# Altium project PWM_CONTROLLER_nverter_540VDC_V3.PrjPcb
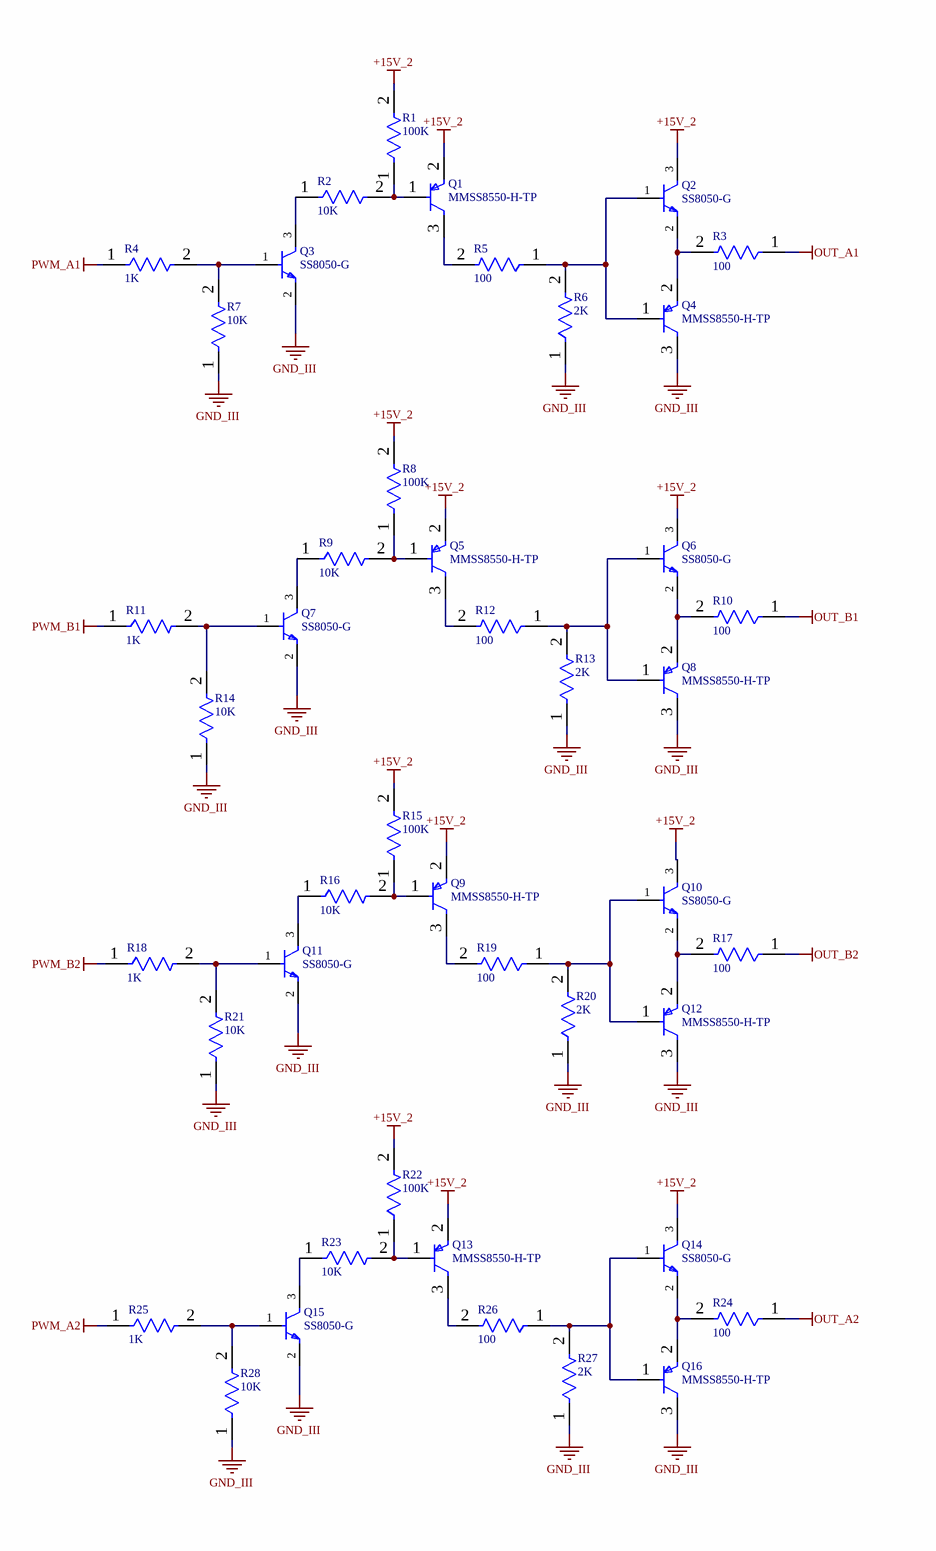
[diagram p0: PWM_CONTROLLER_nverter_540VDC_V3.SchDoc, top middle]
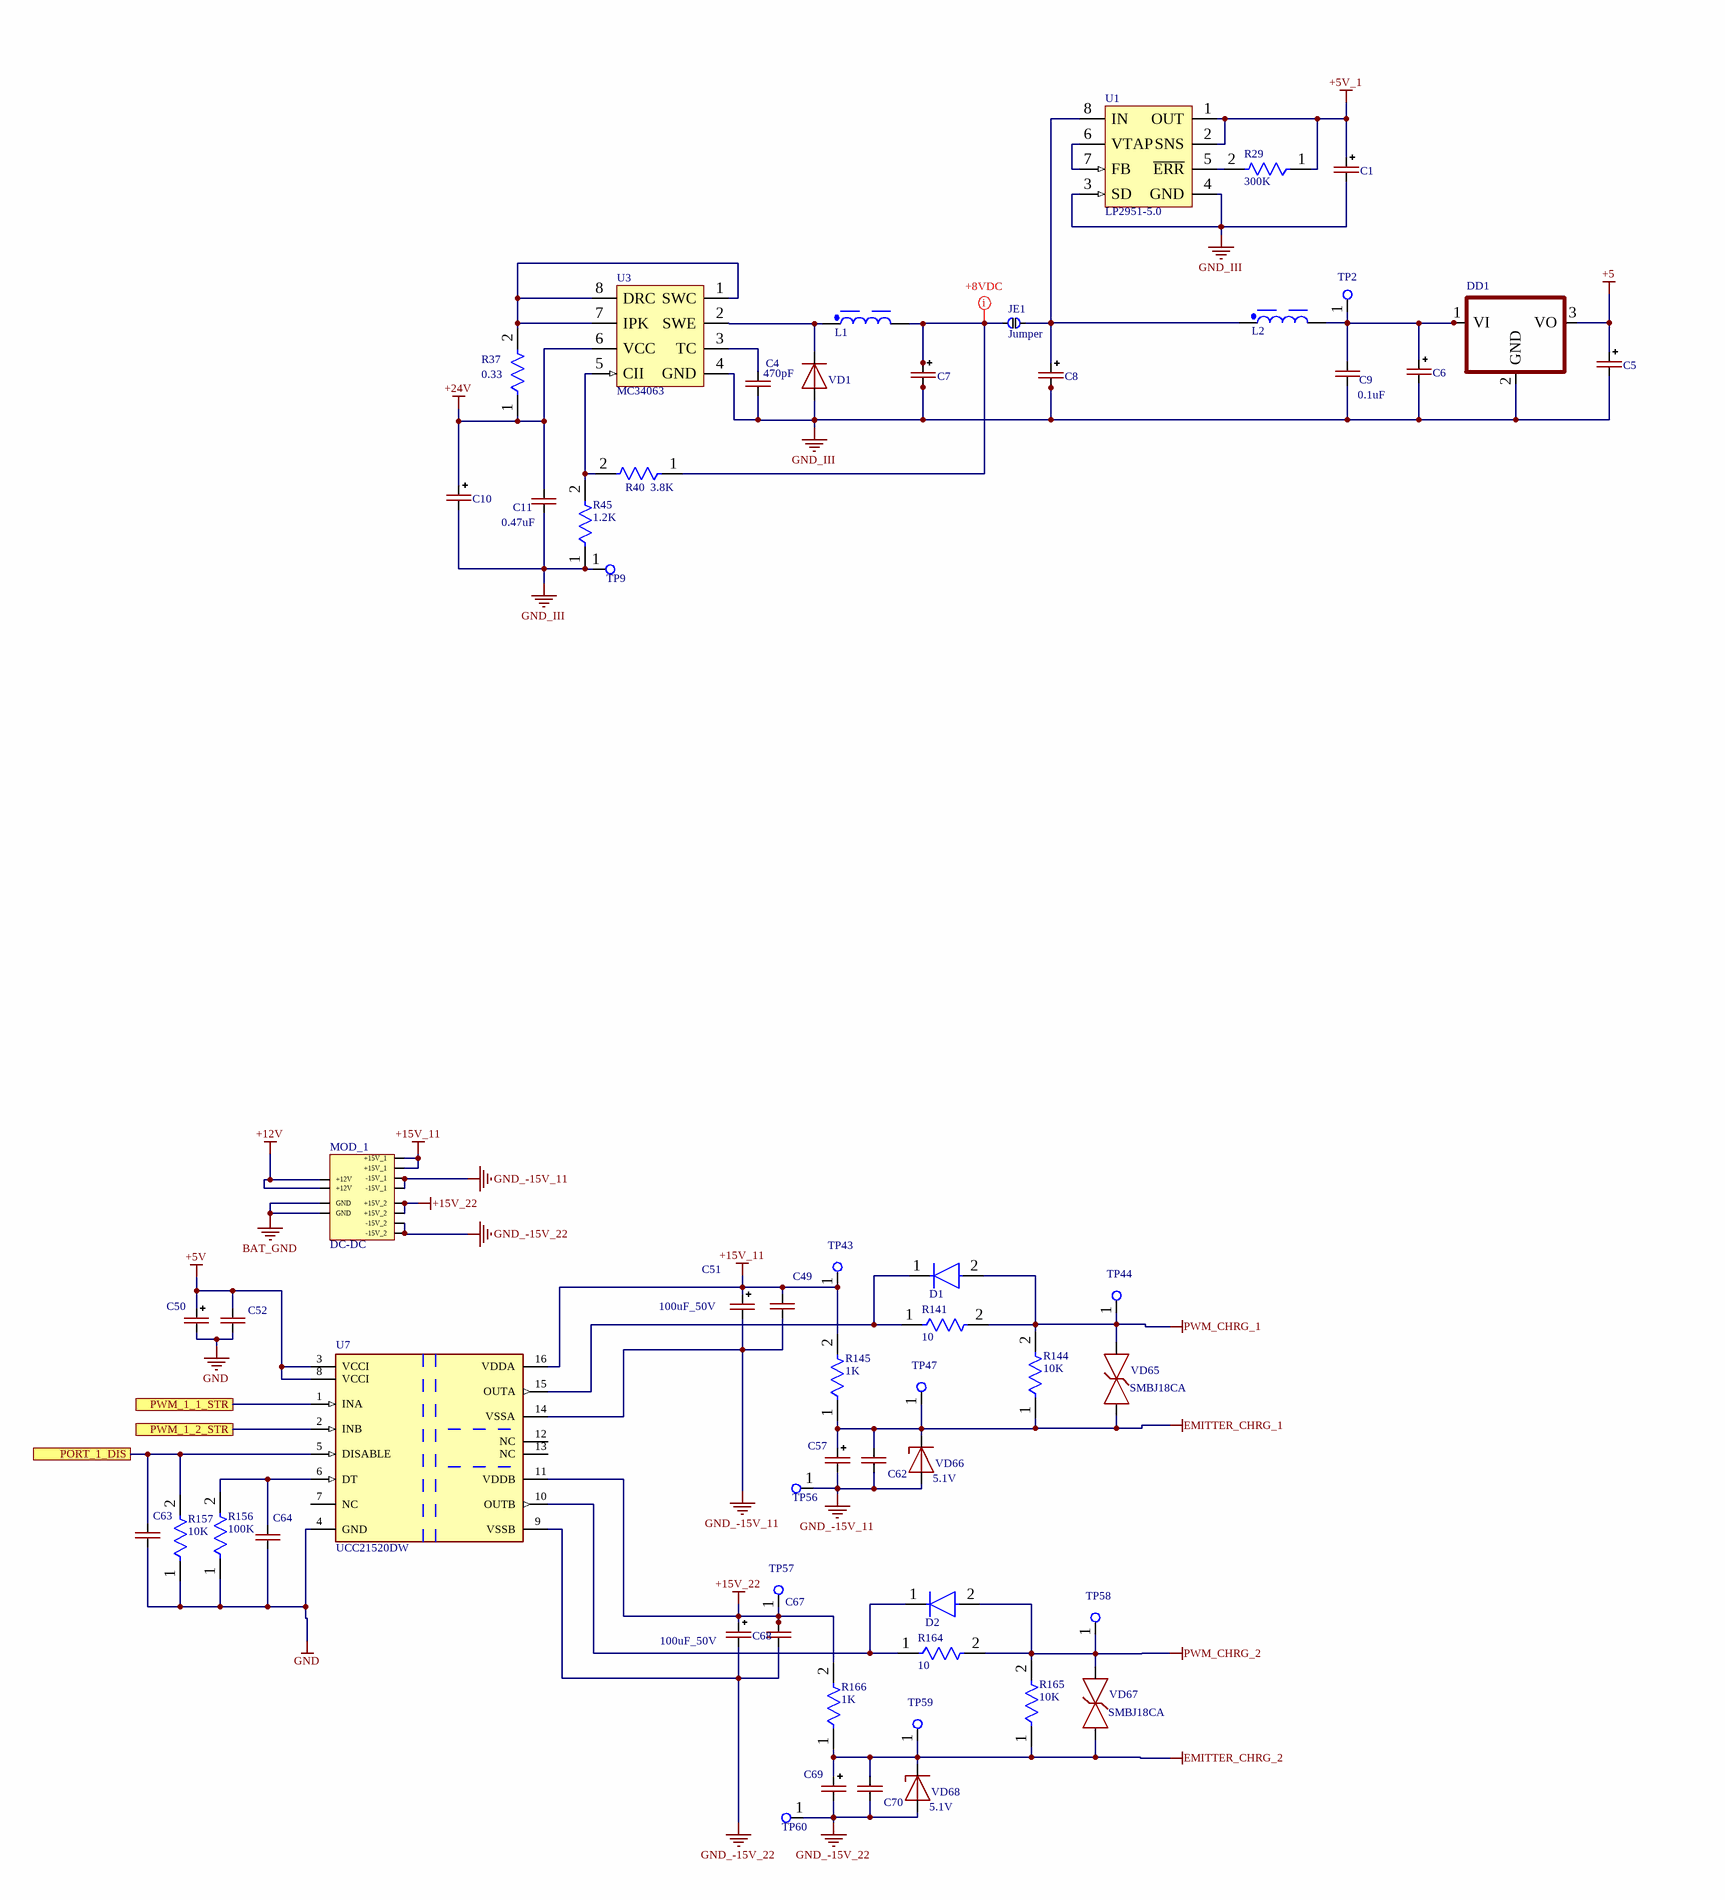
[diagram p1: PWM_CONTROLLER_nverter_540VDC_V3.SchDoc, bottom left]
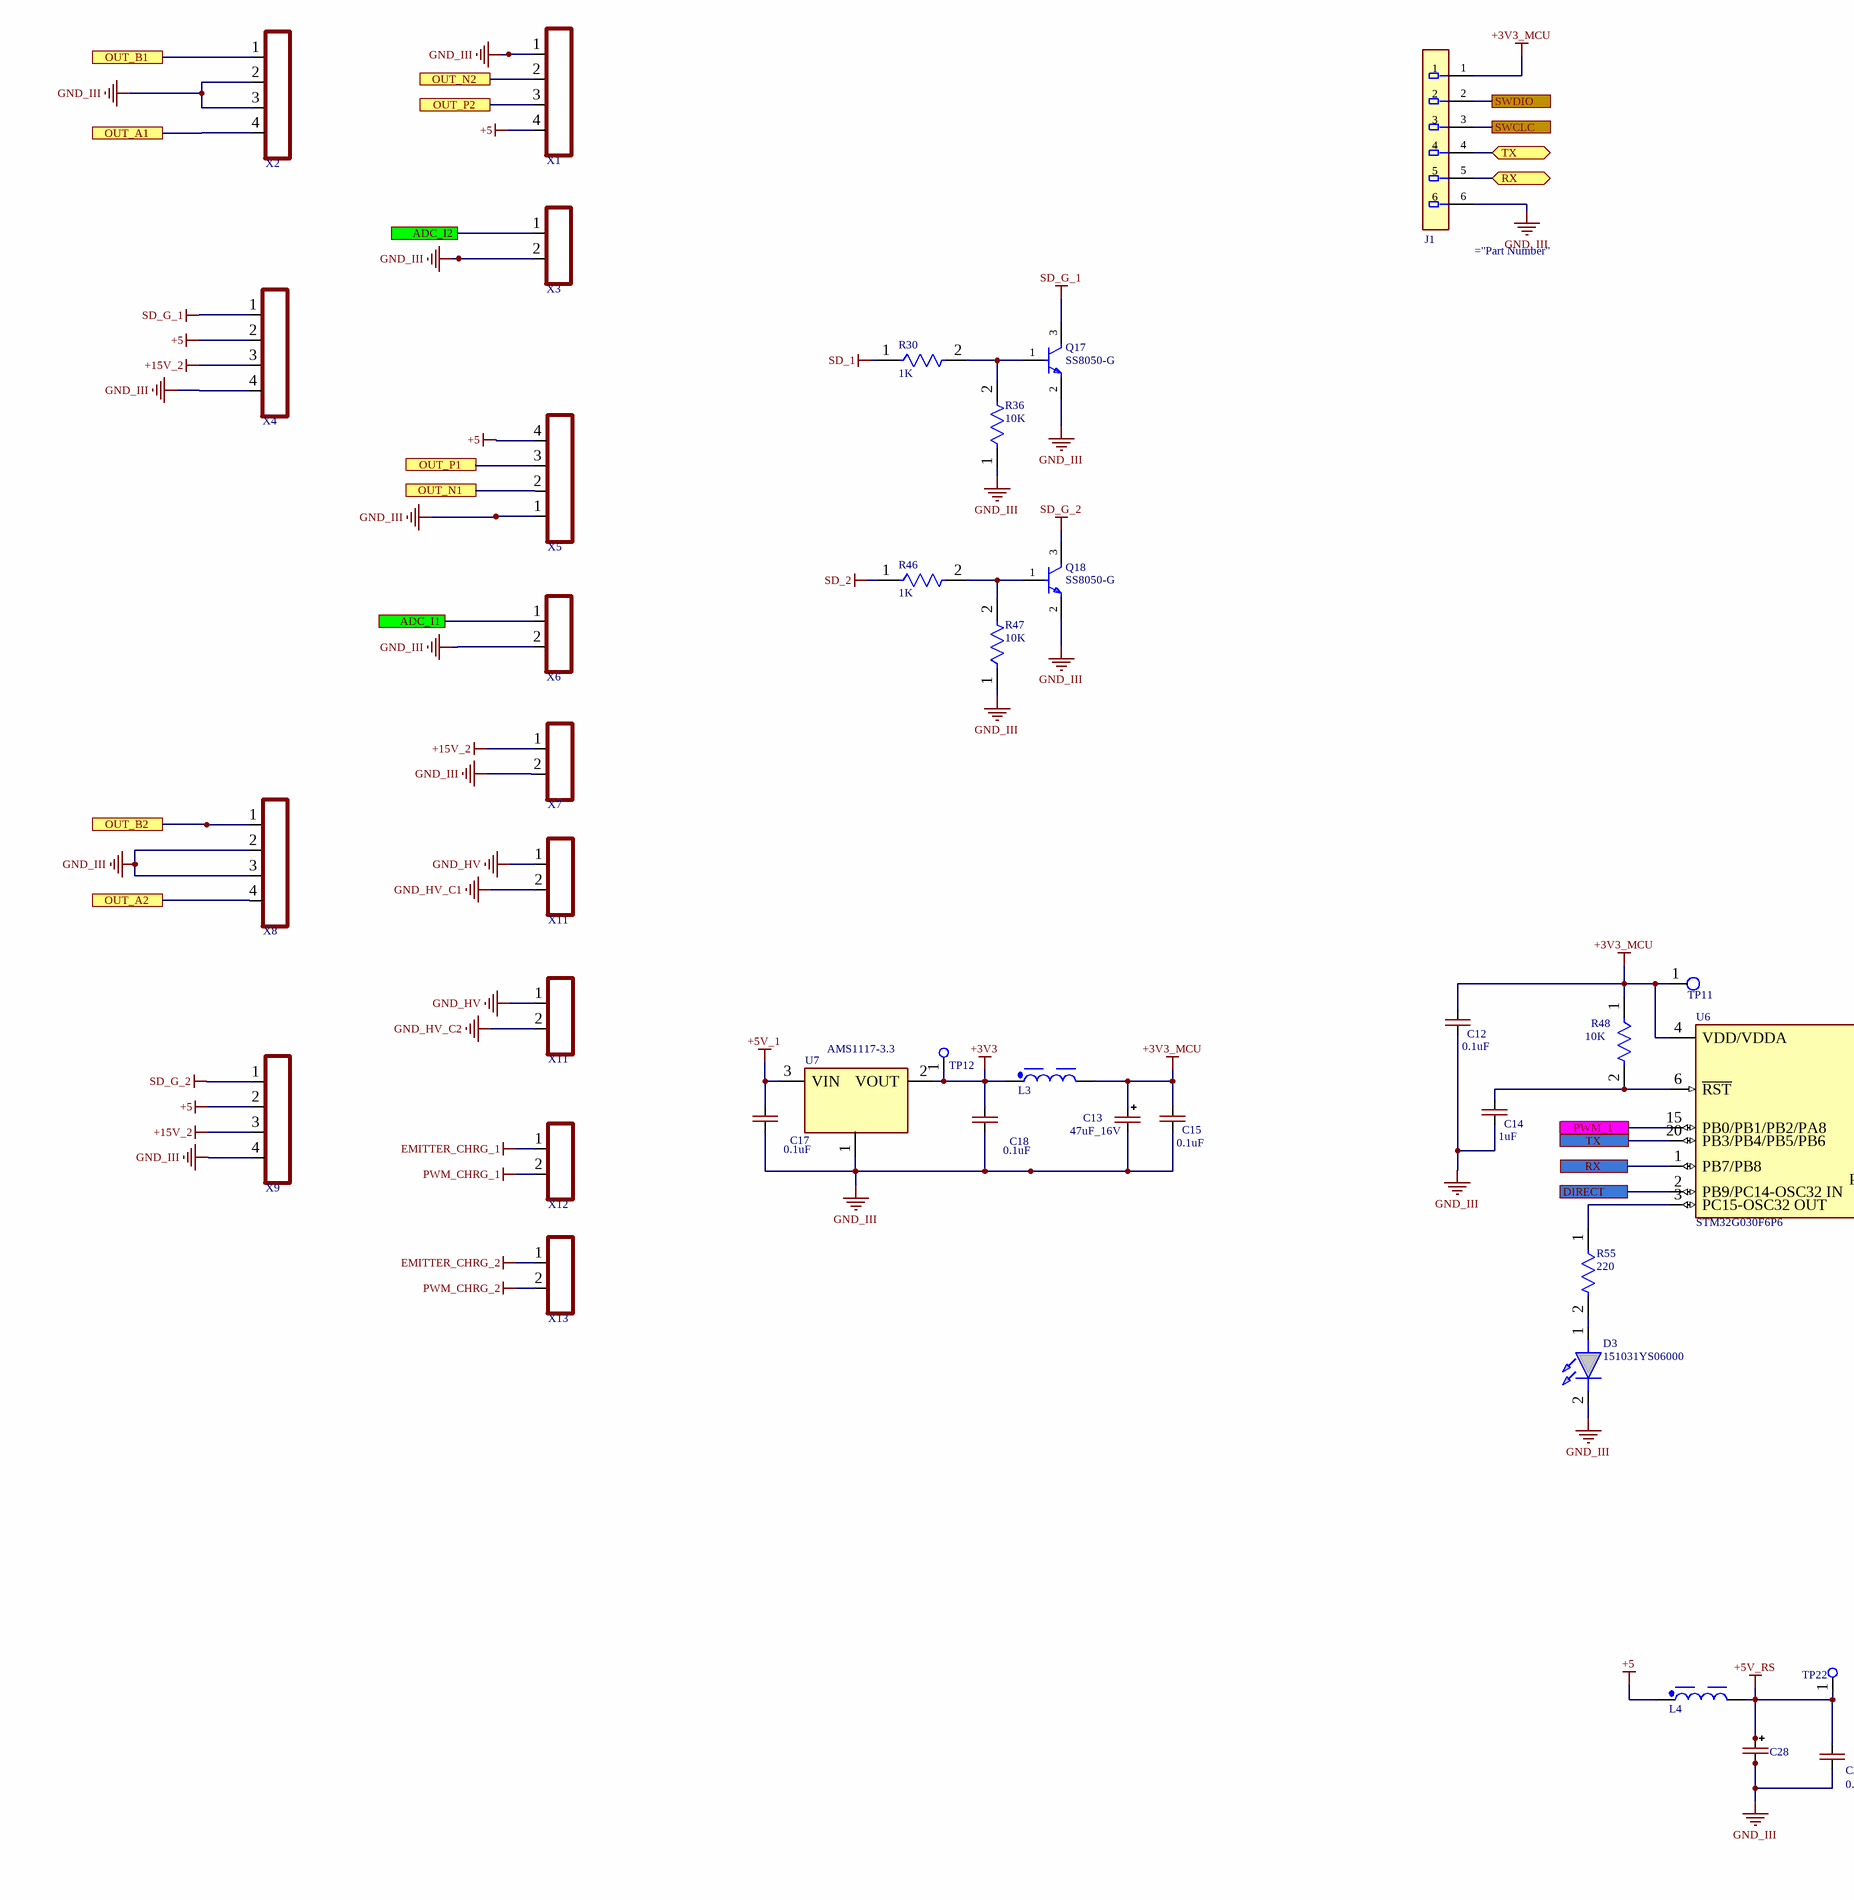
[diagram p2: PWM_CONTROLLER_nverter_540VDC_V3.SchDoc, bottom middle]
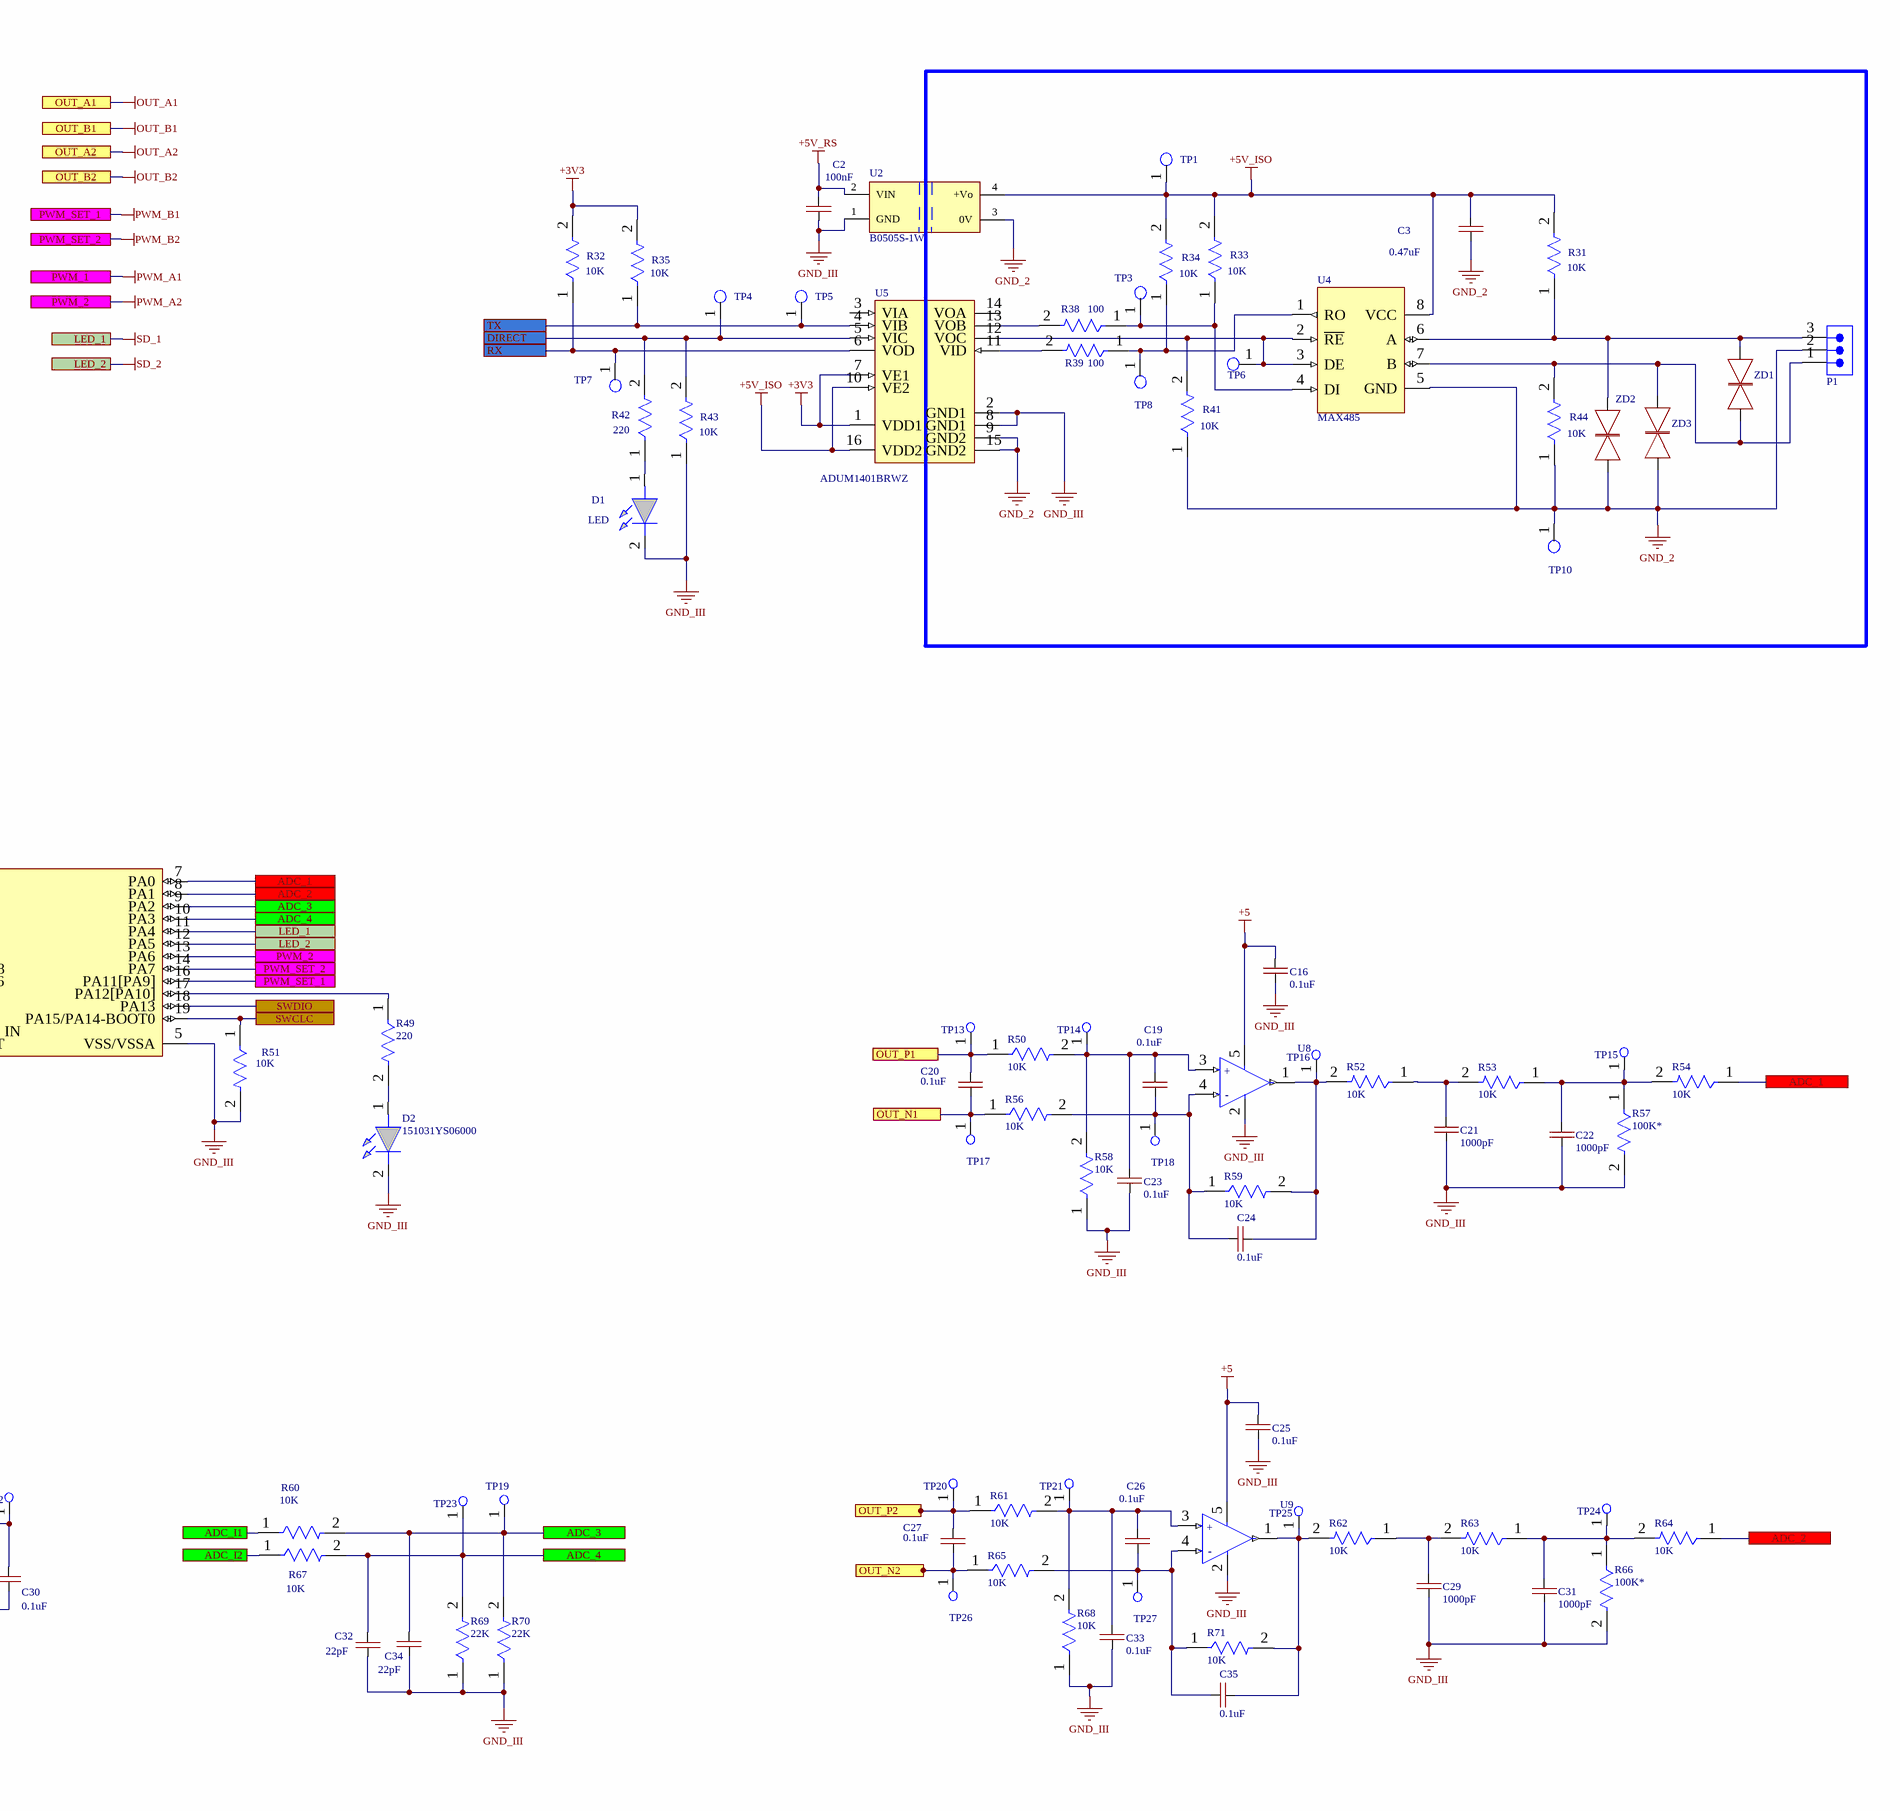
[diagram p3: PWM_CONTROLLER_nverter_540VDC_V3.SchDoc, bottom right]
1 sheet, 224 parts. Net scope: flat (ports and power ports of the same name join across sheets).
Board file: PWM_CONTROLLER_nverter_540VDC_V3.PcbDoc

## Sheet PWM_CONTROLLER_nverter_540VDC_V3.SchDoc
size A0; SheetNumber: 1; SheetTotal: 1; SPICEModelCacheYQEDCYZF: <root> / <DocumentId>YQEDCYZF</DocumentId> / <CacheFrame Number="0"> / <Model Name="7850_74477530_1m" Kind="CKT"> / <Text>******* / .subckt 7850_74477530_1m 1 2 / Rp 1 2 187304.915771 / Cp 1 2 4.36976277949p / Rs 1 N3 3.3 / L1 N3 2 1000u / .ends 7850_74477530_1m</Text> / </Model> / </CacheFrame> / </root>

### Parts
(Parts that share a designator on the sheet are numbered #1, #2 ... from top to bottom, then left to right.)
C1  CAP-POLAR  [CAP-TAN-C]  (value not drawn)
C2  100nF  [CAP-0805]
C3  0.47uF  [CAP-0805]
C4  470pF  [CAP-0805]
C5  CAP-POLAR  [CAP-TAN-C]  (value not drawn)
C6  CAP-POLAR  [CAP-TAN-C]  (value not drawn)
C7  CAP-POLAR  [CAP-TAN-C]  (value not drawn)
C8  CAP-POLAR  [CAP-TAN-C]  (value not drawn)
C9  0.1uF  [CAP-0805]
C10  CAP-POLAR  [CAPPOL_SMD_SIZE_D]  (value not drawn)
C11  0.47uF  [CAP-0805]
C12  0.1uF  [CAP-0805]
C13  47uF_16V  [CAP-TAN-D]
C14  1uF  [CAP-0805]
C15  0.1uF  [CAP-0805]
C16  0.1uF  [CAP-0805]
C17  0.1uF  [CAP-0805]
C18  0.1uF  [CAP-0805]
C19  0.1uF  [CAP-0805]
C20  0.1uF  [CAP-0805]
C21  1000pF  [CAP-0805]
C22  1000pF  [CAP-0805]
C23  0.1uF  [CAP-0805]
C24  0.1uF  [CAP-0805]
C25  0.1uF  [CAP-0805]
C26  0.1uF  [CAP-0805]
C27  0.1uF  [CAP-0805]
C28  CAP-POLAR  [CAP-TAN-C]  (value not drawn)
C29  1000pF  [CAP-0805]
C30  0.1uF  [CAP-0805]
C31  1000pF  [CAP-0805]
C32  22pF  [CAP-0805]
C33  0.1uF  [CAP-0805]
C34  22pF  [CAP-0805]
C35  0.1uF  [CAP-0805]
C49  CAP-NON-POLAR  [CAP-0805]  (value not drawn)
C50  CAP-POLAR  [CAP-TAN-D]  (value not drawn)
C51  100uF_50V  [CAP_SMD_Size_E]
C52  CAP-NON-POLAR  [CAP-0805]  (value not drawn)
C57  CAP-POLAR  [CAP-TAN-D]  (value not drawn)
C62  CAP-NON-POLAR  [CAP-0805]  (value not drawn)
C63  CAP-NON-POLAR  [CAP-0805]  (value not drawn)
C64  CAP-NON-POLAR  [CAP-0805]  (value not drawn)
C67  CAP-NON-POLAR  [CAP-0805]  (value not drawn)
C68  100uF_50V  [CAP_SMD_Size_E]
C69  CAP-POLAR  [CAP-TAN-D]  (value not drawn)
C70  CAP-NON-POLAR  [CAP-0805]  (value not drawn)
D1#1  LED  [LED_RED]
D1#2  US1G  [US1G_SMA]  (value not drawn)
D2#1  151031YS06000  [LED_RED]
D2#2  US1G  [US1G_SMA]  (value not drawn)
D3  151031YS06000  [LED_RED]
DD1  78M05  [DPAK]  (value not drawn)
J1  SWR25X-NRTC-S06-ST-BA  [Sullins_SWR25X-NRTC-S06-ST-BA_MFG]  (value not drawn)
JE1  Jumper  [JE]
L1  1000µH, 0.3A  [WE-PD2_7850]  (value not drawn)
L2  1000µH, 0.3A  [WE-PD2_7850]  (value not drawn)
L3  1000µH, 0.3A  [WE-PD2_7850]  (value not drawn)
L4  1000µH, 0.3A  [WE-PD2_7850]  (value not drawn)
MOD_1  DC-DC  [DC-DC_Bridge]
P1  691701530003B  [691701530003B]  (value not drawn)
Q1  MMSS8550-H-TP  [FP-SOT-23-IPC_B]
Q2  SS8050-G  [FP-SS8050-G-MFG]
Q3  SS8050-G  [FP-SS8050-G-MFG]
Q4  MMSS8550-H-TP  [FP-SOT-23-IPC_B]
Q5  MMSS8550-H-TP  [FP-SOT-23-IPC_B]
Q6  SS8050-G  [FP-SS8050-G-MFG]
Q7  SS8050-G  [FP-SS8050-G-MFG]
Q8  MMSS8550-H-TP  [FP-SOT-23-IPC_B]
Q9  MMSS8550-H-TP  [FP-SOT-23-IPC_B]
Q10  SS8050-G  [FP-SS8050-G-MFG]
Q11  SS8050-G  [FP-SS8050-G-MFG]
Q12  MMSS8550-H-TP  [FP-SOT-23-IPC_B]
Q13  MMSS8550-H-TP  [FP-SOT-23-IPC_B]
Q14  SS8050-G  [FP-SS8050-G-MFG]
Q15  SS8050-G  [FP-SS8050-G-MFG]
Q16  MMSS8550-H-TP  [FP-SOT-23-IPC_B]
Q17  SS8050-G  [FP-SS8050-G-MFG]
Q18  SS8050-G  [FP-SS8050-G-MFG]
R1  100K  [RES-0805]
R2  10K  [RES-0805]
R3  100  [RES-0805]
R4  1K  [RES-0805]
R5  100  [RES-0805]
R6  2K  [RES-0805]
R7  10K  [RES-0805]
R8  100K  [RES-0805]
R9  10K  [RES-0805]
R10  100  [RES-0805]
R11  1K  [RES-0805]
R12  100  [RES-0805]
R13  2K  [RES-0805]
R14  10K  [RES-0805]
R15  100K  [RES-0805]
R16  10K  [RES-0805]
R17  100  [RES-0805]
R18  1K  [RES-0805]
R19  100  [RES-0805]
R20  2K  [RES-0805]
R21  10K  [RES-0805]
R22  100K  [RES-0805]
R23  10K  [RES-0805]
R24  100  [RES-0805]
R25  1K  [RES-0805]
R26  100  [RES-0805]
R27  2K  [RES-0805]
R28  10K  [RES-0805]
R29  300K  [RES-0805]
R30  1K  [RES-0805]
R31  10K  [RES-0805]
R32  10K  [RES-0805]
R33  10K  [RES-0805]
R34  10K  [RES-0805]
R35  10K  [RES-0805]
R36  10K  [RES-0805]
R37  0.33  [RES-1206]
R38  100  [RES-0805]
R39  100  [RES-0805]
R40  3.8K  [RES-0805]
R41  10K  [RES-0805]
R42  220  [RES-0805]
R43  10K  [RES-0805]
R44  10K  [RES-0805]
R45  1.2K  [RES-0805]
R46  1K  [RES-0805]
R47  10K  [RES-0805]
R48  10K  [RES-0805]
R49  220  [RES-0805]
R50  10K  [RES-0805]
R51  10K  [RES-0805]
R52  10K  [RES-0805]
R53  10K  [RES-0805]
R54  10K  [RES-0805]
R55  220  [RES-0805]
R56  10K  [RES-0805]
R57  100K*  [RES-0805]
R58  10K  [RES-0805]
R59  10K  [RES-0805]
R60  10K  [RES-0805]
R61  10K  [RES-0805]
R62  10K  [RES-0805]
R63  10K  [RES-0805]
R64  10K  [RES-0805]
R65  10K  [RES-0805]
R66  100K*  [RES-0805]
R67  10K  [RES-0805]
R68  10K  [RES-0805]
R69  22K  [RES-0805]
R70  22K  [RES-0805]
R71  10K  [RES-0805]
R141  10  [RES-2512]
R144  10K  [RES-0805]
R145  1K  [RES-2512]
R156  100K  [RES-0805]
R157  10K  [RES-0805]
R164  10  [RES-2512]
R165  10K  [RES-0805]
R166  1K  [RES-2512]
TP1  Test_Point_PCB  [Test_Point]  (value not drawn)
TP2  Test_Point_PCB  [Test_Point]  (value not drawn)
TP3  Test_Point_PCB  [Test_Point]  (value not drawn)
TP4  Test_Point_PCB  [Test_Point]  (value not drawn)
TP5  Test_Point_PCB  [Test_Point]  (value not drawn)
TP6  Test_Point_PCB  [Test_Point]  (value not drawn)
TP7  Test_Point_PCB  [Test_Point]  (value not drawn)
TP8  (no value)  [Test_Point]
TP9  Test_Point_PCB  [Test_Point]  (value not drawn)
TP10  Test_Point_PCB  [Test_Point]  (value not drawn)
TP11  (no value)  [Test_Point]
TP12  Test_Point_PCB  [Test_Point]  (value not drawn)
TP13  Test_Point_PCB  [Test_Point]  (value not drawn)
TP14  Test_Point_PCB  [Test_Point]  (value not drawn)
TP15  Test_Point_PCB  [Test_Point]  (value not drawn)
TP16  Test_Point_PCB  [Test_Point]  (value not drawn)
TP17  Test_Point_PCB  [Test_Point]  (value not drawn)
TP18  Test_Point_PCB  [Test_Point]  (value not drawn)
TP19  Test_Point_PCB  [Test_Point]  (value not drawn)
TP20  Test_Point_PCB  [Test_Point]  (value not drawn)
TP21  Test_Point_PCB  [Test_Point]  (value not drawn)
TP22  Test_Point_PCB  [Test_Point]  (value not drawn)
TP23  Test_Point_PCB  [Test_Point]  (value not drawn)
TP24  Test_Point_PCB  [Test_Point]  (value not drawn)
TP25  Test_Point_PCB  [Test_Point]  (value not drawn)
TP26  Test_Point_PCB  [Test_Point]  (value not drawn)
TP27  Test_Point_PCB  [Test_Point]  (value not drawn)
TP43  Test_Point_PCB  [Test_Point]  (value not drawn)
TP44  Test_Point_PCB  [Test_Point]  (value not drawn)
TP47  Test_Point_PCB  [Test_Point]  (value not drawn)
TP56  Test_Point_PCB  [Test_Point]  (value not drawn)
TP57  Test_Point_PCB  [Test_Point]  (value not drawn)
TP58  Test_Point_PCB  [Test_Point]  (value not drawn)
TP59  Test_Point_PCB  [Test_Point]  (value not drawn)
TP60  Test_Point_PCB  [Test_Point]  (value not drawn)
U1  LP2951-5.0  [SOIC-8_L]
U2  B0505S-1W  [B0505S-1W]
U3  MC34063  [SOIC-8_M]
U4  MAX485  [SOIC-8-MFG]
U5  ADUM1401BRWZ  [ADI-RW-16_M]
U6  STM32G030F6P6  [FP-TSSOP20-YA-IPC_A]
U7#1  AMS1117-3.3  [SOT-223]
U7#2  UCC21520DW  [FP-DW0016B-MFG]
U8  (no value)  [SOT-23-5]
U9  (no value)  [SOT-23-5]
VD1  DIODE  [DO-214AC, SMA]  (value not drawn)
VD65  SMBJ18CA  [DO-214AA]
VD66  5.1V  [DO-35]
VD67  SMBJ18CA  [DO-214AA]
VD68  5.1V  [DO-35]
X1  CONN-4-PIN  [CONN-PLS-4-2.54mm_1]  (value not drawn)
X2  CONN-4-PIN  [CONN-PLS-4-2.54mm_1]  (value not drawn)
X3  CONN-2-PIN  [XH2-]  (value not drawn)
X4  CONN-4-PIN  [CONN-PLS-4-2.54mm_1]  (value not drawn)
X5  CONN-4-PIN  [CONN-PLS-4-2.54mm_1]  (value not drawn)
X6  CONN-2-PIN  [XH2-]  (value not drawn)
X7  CONN-2-PIN  [XH2-]  (value not drawn)
X8  CONN-4-PIN  [CONN-PLS-4-2.54mm_1]  (value not drawn)
X9  CONN-4-PIN  [CONN-PLS-4-2.54mm_1]  (value not drawn)
X11#1  CONN-2-PIN  [XH2-]  (value not drawn)
X11#2  CONN-2-PIN  [XH2-]  (value not drawn)
X12  CONN-2-PIN  [XH2-]  (value not drawn)
X13  CONN-2-PIN  [XH2-]  (value not drawn)
ZD1  P6SMB16CA  [DO-214AA]  (value not drawn)
ZD2  P6SMB16CA  [DO-214AA]  (value not drawn)
ZD3  P6SMB16CA  [DO-214AA]  (value not drawn)

### Ports
ADC_1, ADC_2, ADC_3, ADC_4, ADC_I1, ADC_I2, DIRECT, LED_1, LED_2, OUT_A1, OUT_A2, OUT_B1, OUT_B2, OUT_N1, OUT_N2, OUT_P1, OUT_P2, PORT_1_DIS, PWM_1, PWM_1_1_STR, PWM_1_2_STR, PWM_2, PWM_SET_1, PWM_SET_2, RX, RX (bidir), SWCLC, SWDIO, TX, TX (bidir)

### Nets
+3V3: C18.2 L3.1 R32.2 R35.2 TP12.1(G9) U5.1(VDD1) U5.7(VE1) U7#1.2(VOUT)
+3V3_MCU: C12.2 C13.1(+) C15.2 J1.1 L3.2 R48.1 TP11.1(G9) U6.4(VDD/VDDA)
+5: C5.1(+) C16.2 C25.2 DD1.3(VO) L4.1 U8.5(VDD) U9.5(VDD) X1.4 X4.2 X5.4 X9.2
+5V: C50.1(+) C52.2 U7#2.3(VCCI) U7#2.8(VCCI)
+5V_1: C1.1(+) C17.2 R29.1 U1.1(OUT) U1.2(SNS) U7#1.3(VIN)
+5V_ISO: C3.1 R31.2 R33.2 R34.2 TP1.1(G9) U2.4(+Vo) U4.8(VCC) U5.10(VE2) U5.16(VDD2)
+5V_RS: C2.2 C28.1(+) C30.2 L4.2 TP22.1(G9) U2.2(VIN)
+12V: MOD_1.8(+12V) MOD_1.9(+12V)
+15V_2: Q1.2(E) Q2.3(C) Q5.2(E) Q6.3(C) Q9.2(E) Q10.3(C) Q13.2(E) Q14.3(C) R1.2 R8.2 R15.2 R22.2 X4.3 X7.1 X9.3
+15V_11: C49.2 C51.1(+) MOD_1.1(+15V_1) MOD_1.2(+15V_1) R145.2 TP43.1(G9) U7#2.16(VDDA)
+15V_22: C67.2 C68.1(+) MOD_1.17(+15V_2) MOD_1.18(+15V_2) R166.2 TP57.1(G9) U7#2.11(VDDB)
+24V: C10.1(+) C11.1 R37.1 U3.6(VCC)
BAT_GND: MOD_1.10(GND) MOD_1.11(GND)
EMITTER_CHRG_1: C57.1(+) C62.2 R144.1 R145.1 TP47.1(G9) VD65.1(C) VD66.1(C) X12.1
EMITTER_CHRG_2: C69.1(+) C70.2 R165.1 R166.1 TP59.1(G9) VD67.1(C) VD68.1(C) X13.1
GND: C50.2(-) C52.1 C63.1 C64.1 R156.1 R157.1 U7#2.4(GND)
GND_2: C3.2 P1.2 R41.1 R44.1 TP10.1(G9) U2.3(0V) U4.5(GND) U5.9(GND2) U5.15(GND2) ZD2.1(A) ZD3.1(A)
GND_-15V_11: C49.1 C51.2(-) C57.2(-) C62.1 MOD_1.3(-15V_1) MOD_1.4(-15V_1) TP56.1(G9) U7#2.14(VSSA) VD66.2(A)
GND_-15V_22: C67.1 C68.2(-) C69.2(-) C70.1 MOD_1.15(-15V_2) MOD_1.16(-15V_2) TP60.1(G9) U7#2.9(VSSB) VD68.2(A)
GND_HV: X11#1.1 X11#2.1
GND_HV_C1: X11#1.2
GND_HV_C2: X11#2.2
GND_III: C1.2(-) C2.1 C4.2 C5.2(-) C6.2(-) C7.2(-) C8.2(-) C9.1 C10.2(-) C11.2 C12.1 C13.2(-) C14.1 C15.1 C16.1 C17.1 C18.1 C21.1 C22.1 C23.1 C25.1 C28.2(-) C29.1 C30.1 C31.1 C32.1 C33.1 C34.1 D1#1.2(K) D2#1.2(K) D3.2(K) DD1.2(GND) J1.6 Q3.2(E) Q4.3(C) Q7.2(E) Q8.3(C) Q11.2(E) Q12.3(C) Q15.2(E) Q16.3(C) Q17.2(E) Q18.2(E) R6.1 R7.1 R13.1 R14.1 R20.1 R21.1 R27.1 R28.1 R36.1 R43.1 R45.1 R47.1 R51.2 R57.2 R58.1 R66.2 R68.1 R69.1 R70.1 TP9.1(G9) U1.3(SD) U1.4(GND) U2.1(GND) U3.4(GND) U5.2(GND1) U5.8(GND1) U6.5(VSS/VSSA) U7#1.1(Ground) U8.2(VSS) U9.2(VSS) VD1.2(A) X1.1 X2.2 X2.3 X3.2 X5.1 X6.2 X7.2 X8.2 X8.3 X9.4
OUT_A1: R3.1 X2.4 ; port OUT_A1
OUT_A2: R24.1 X8.4 ; port OUT_A2
OUT_B1: R10.1 X2.1 ; port OUT_B1
OUT_B2: R17.1 X8.1 ; port OUT_B2
PWM_A1: R4.1 U6.15(PB0/PB1/PB2/PA8) ; port PWM_1
PWM_A2: R25.1 U6.13(PA6) ; port PWM_2
PWM_B1: R11.1 U6.16(PA11[PA9]) ; port PWM_SET_1
PWM_B2: R18.1 U6.14(PA7) ; port PWM_SET_2
PWM_CHRG_1: D1#2.2(A) R141.2 R144.2 TP44.1(G9) VD65.2(A) X12.2
PWM_CHRG_2: D2#2.2(A) R164.2 R165.2 TP58.1(G9) VD67.2(A) X13.2
SD_1: R30.1 U6.11(PA4) ; port LED_1
SD_2: R46.1 U6.12(PA5) ; port LED_2
SD_G_1: Q17.3(C) X4.1
SD_G_2: Q18.3(C) X9.1
NetC4_1: C4.1 U3.3(TC)
NetC6_1: C6.1(+) C9.2 DD1.1(VI) L2.2 TP2.1(G9)
NetC7_1: C7.1(+) JE1.2 L1.2 R40.1
NetC8_1: C8.1(+) JE1.1 L2.1 U1.8(IN)
NetC14_2: C14.2 R48.2 U6.6(~{RST})
NetC19_1: C19.1 C24.1 R56.2 R59.1 TP18.1(G9) U8.4(VIN-)
NetC19_2: C19.2 C23.2 R50.2 R58.2 TP14.1(G9) U8.3(VIN+)
NetC20_1: C20.1 R56.1 TP17.1(G9) X5.2 ; port OUT_N1
NetC20_2: C20.2 R50.1 TP13.1(G9) X5.3 ; port OUT_P1
NetC21_2: C21.2 R52.1 R53.2
NetC22_2: C22.2 R53.1 R54.2 R57.1 TP15.1(G9)
NetC24_2: C24.2 R52.2 R59.2 TP16.1(G9) U8.1(VOUT)
NetC26_1: C26.1 C35.1 R65.2 R71.1 TP27.1(G9) U9.4(VIN-)
NetC26_2: C26.2 C33.2 R61.2 R68.2 TP21.1(G9) U9.3(VIN+)
NetC27_1: C27.1 R65.1 TP26.1(G9) X1.2 ; port OUT_N2
NetC27_2: C27.2 R61.1 TP20.1(G9) X1.3 ; port OUT_P2
NetC29_2: C29.2 R62.1 R63.2
NetC31_2: C31.2 R63.1 R64.2 R66.1 TP24.1(G9)
NetC32_2: C32.2 R67.2 R69.2 TP23.1(G9) U6.10(PA3) ; port ADC_4
NetC34_2: C34.2 R60.2 R70.2 TP19.1(G9) U6.9(PA2) ; port ADC_3
NetC35_2: C35.2 R62.2 R71.2 TP25.1(G9) U9.1(VOUT)
NetC63_2: C63.2 R157.2 U7#2.5(DISABLE) ; port PORT_1_DIS
NetC64_2: C64.2 R156.2 U7#2.6(DT)
NetD1#1_1: D1#1.1(A) R42.1
NetD1#2_1: D1#2.1(C) R141.1 U7#2.15(OUTA)
NetD2#1_1: D2#1.1(A) R49.2
NetD2#2_1: D2#2.1(C) R164.1 U7#2.10(OUTB)
NetD3_1: D3.1(A) R55.2
NetJ1_2: J1.2 U6.18(PA13) ; port SWDIO
NetJ1_3: J1.3 R51.1 U6.19(PA15/PA14-BOOT0) ; port SWCLC
NetJ1_4: J1.4 R35.1 TP5.1(G9) U5.4(VIB) U6.20(PB3/PB4/PB5/PB6) ; port TX
NetJ1_5: J1.5 R32.1 TP7.1(G9) U5.6(VOD) U6.1(PB7/PB8) ; port RX
NetL1_1: L1.1 U3.2(SWE) VD1.1(C)
NetP1_1: P1.1 R44.2 U4.7(B) ZD1.1(A) ZD3.2(A)
NetP1_3: P1.3 R31.1 U4.6(A) ZD1.2(A) ZD2.2(A)
NetQ1_1: Q1.1(B) R1.1 R2.2
NetQ1_3: Q1.3(C) R5.2
NetQ2_1: Q2.1(B) Q4.1(B) R5.1 R6.2
NetQ2_2: Q2.2(E) Q4.2(E) R3.2
NetQ3_1: Q3.1(B) R4.2 R7.2
NetQ3_3: Q3.3(C) R2.1
NetQ5_1: Q5.1(B) R8.1 R9.2
NetQ5_3: Q5.3(C) R12.2
NetQ6_1: Q6.1(B) Q8.1(B) R12.1 R13.2
NetQ6_2: Q6.2(E) Q8.2(E) R10.2
NetQ7_1: Q7.1(B) R11.2 R14.2
NetQ7_3: Q7.3(C) R9.1
NetQ9_1: Q9.1(B) R15.1 R16.2
NetQ9_3: Q9.3(C) R19.2
NetQ10_1: Q10.1(B) Q12.1(B) R19.1 R20.2
NetQ10_2: Q10.2(E) Q12.2(E) R17.2
NetQ11_1: Q11.1(B) R18.2 R21.2
NetQ11_3: Q11.3(C) R16.1
NetQ13_1: Q13.1(B) R22.1 R23.2
NetQ13_3: Q13.3(C) R26.2
NetQ14_1: Q14.1(B) Q16.1(B) R26.1 R27.2
NetQ14_2: Q14.2(E) Q16.2(E) R24.2
NetQ15_1: Q15.1(B) R25.2 R28.2
NetQ15_3: Q15.3(C) R23.1
NetQ17_1: Q17.1(B) R30.2 R36.2
NetQ18_1: Q18.1(B) R46.2 R47.2
NetR29_2: R29.2 U1.5(~{ERR})
NetR33_1: R33.1 R38.1 TP3.1(G9) U4.4(DI)
NetR34_1: R34.1 R39.1 TP8.1(G9) U4.1(RO)
NetR37_2: R37.2 U3.1(SWC) U3.7(IPK) U3.8(DRC)
NetR38_2: R38.2 U5.13(VOB)
NetR39_2: R39.2 U5.11(VID)
NetR40_2: R40.2 R45.2 U3.5(CII)
NetR41_2: R41.2 TP6.1(G9) U4.2(~{RE}) U4.3(DE) U5.12(VOC)
NetR42_2: R42.2 R43.2 TP4.1(G9) U5.5(VIC) U6.2(PB9/PC14-OSC32_IN) ; port DIRECT
NetR49_1: R49.1 U6.17(PA12[PA10])
NetR54_1: R54.1 U6.7(PA0) ; port ADC_1
NetR55_1: R55.1 U6.3(PC15-OSC32_OUT)
NetR60_1: R60.1 X6.1 ; port ADC_I1
NetR64_1: R64.1 U6.8(PA1) ; port ADC_2
NetR67_1: R67.1 X3.1 ; port ADC_I2
NetU1_6: U1.6(VTAP) U1.7(FB)
NetU7#2_1: U7#2.1(INA) ; port PWM_1_1_STR
NetU7#2_2: U7#2.2(INB) ; port PWM_1_2_STR

Not connected (* = marked no-connect by the designer): U5 3(VIA) 14(VOA); U7#2 7(NC) 12(NC) 13(NC); X4 4

### Layout directives
mark named +8VDC: (no net found under the mark)

### Notes on the sheet
- (in symbol MCP6001T) +; -

### Library data of the parts
C2-C4 C9 C11 C12 C14-C27 C29-C35 = CAP-NON-POLAR
C13 C51 C68 = CAP-POLAR
D1#1 D2#1 D3 = LED: WURTH ELEKTRONIK - 151031YS06000 - LED, Yellow, Through Hole, T-1 (3mm), 30 mA, 2 V, 590 nm; Geometry.Height: 5.5mm; Manufacturer_Name: Wurth Elektronik; Manufacturer_Part_Number: 151031YS06000; Mouser Part Number: 710-151031YS06000; Mouser Price/Stock: https://www.mouser.co.uk/ProductDetail/Wurth-Elektronik/151031YS06000?qs=LlUlMxKIyB3xSYYW%252BcuBiQ%3D%3D; Arrow Part Number: *; Arrow Price/Stock: *; Mouser Testing Part Number: *; Mouser Testing Price/Stock: *; Datasheet Link: https://katalog.we-online.de/led/datasheet/151031YS06000.pdf
JE1 = JE
L1-L4 = 74477530: WE-PD2 SMT Power Inductor, size 7850, 1000µH, 0.3A, 3.3Ω; Manufacturer: Wurth Elektronik; Case/Size Code: 7850; DC Resistance: 2.78Ω; Self Resonant Frequency: 2.4MHz; Manufacturer Part Number: 74477530; Category: Unshielded Power Inductors; Match Code: WE-PD2; ComponentLink1Description: Website Link; ComponentLink1URL: https://www.we-online.com/redexpert/article/74477530?ad; ComponentLink2Description: Datasheet Link; ComponentLink2URL: https://www.we-online.com/redexpert/spec/74477530?ad; Mount: Surface Mount; Operating Temperature Max: 125°C; Operating Temperature Min: -40°C; Packaging: Tape and Reel; Length: 7.8mm; Width: 7mm; Height: 4.95mm; DC Resistance Max: 3.3Ω; Inductance: 1000µH; Rated Current: 0.3A; Saturation Current: 0.3A
MOD_1 = DC-DC/12-18VDC
P1 = 691701530003B: WR-TBL Series 7015B Open Horizontal PCB Header, SMT, pitch 5.08mm, 3p; Manufacturer: Wurth Elektronik; Modularity: No; Rated Current: 10A; Working Voltage: 300V; ComponentLink1Description: Website Link; ComponentLink1URL: https://www.we-online.com/redexpert/article/691701530003B?ad; ComponentLink2Description: Datasheet Link; ComponentLink2URL: https://www.we-online.com/redexpert/spec/691701530003B?ad; Manufacturer Part Number: 691701530003B; Category: Terminal Blocks; Match Code: WR-TBL; Mount: Surface Mount; Operating Temperature Max: 105°C; Operating Temperature Min: -40°C; Packaging: Box; Application: Pluggable; Number of Pins: 3; Number of Rows: 1; Orientation: Horizontal; Pitch: 5.08mm
Q1 Q4 Q5 Q8 Q9 Q12 Q13 Q16 = CMP-56214-000002-1: TRANS PNP 25V 1.5A SOT23; Emitter Base Voltage (VEBO): 1.6V; Collector Base Voltage (VCBO): 40V; Collector Emitter Saturation Voltage: 500mV; Max Power Dissipation: 625mW; Transition Frequency: 100MHz; Element Configuration: Single; hFE Min: 40; Polarity: PNP; Lead Free: Lead Free; Max Breakdown Voltage: 25V; Package Quantity: 1; Min Operating Temperature: -55°C; Case/Package: SOT-23; Max Collector Current: 1.5A; Mount: Surface Mount; Packaging: Tape and Reel; Collector Emitter Voltage (VCEO): 500mV; Max Operating Temperature: 150°C; Gain Bandwidth Product: 100MHz; Collector Emitter Breakdown Voltage: 25V
Q2 Q3 Q6 Q7 Q10 Q11 Q14 Q15 Q17 Q18 = CMP-20235-000001-1: NPN TRANSISTOR 1.5A 40V SOT-23 R; Transition Frequency: 100MHz; Max Breakdown Voltage: 25V; Collector Emitter Voltage (VCEO): 400mV; Max Power Dissipation: 300mW; Max Collector Current: 1.5A; Case/Package: TO-236-3; Packaging: Tape and Reel; RoHS Compliant: Yes; Mount: Surface Mount; Collector Emitter Breakdown Voltage: 25V
R1-R39 R41-R71 R141 R144 R145 R156 R157 R164-R166 = RES-CONST
R40 = RES-CONST: 10K
TP1-TP27 TP43 TP44 TP47 TP56-TP60 = TP_PCB?: Test_Point
U1 = LP2951-3.3
U5 = CMP-0534-00565-1: Quad Channel Digital Isolator, 2.5 KV rms Insulation Rating, 10 Mbps Data Rate, 50 ns Delay, Industrial, 16-pin SOIC (RW-16), Tube; Manufacturer: Analog Devices; Max Data Rate: 10Mbps; ComponentLink2URL: http://www.analog.com/static/imported-files/data_sheets/ADuM1400_1401_1402.pdf; ComponentLink5Description: URL Link2; ComponentLink3URL: http://www.analog.com/static/imported-files/packages/PKG_PDF/SOIC_WIDE%20%28RW%29/RW_16.pdf; DatasheetVersion: Rev. H; ComponentLink2Description: Datasheet; ComponentLink3Description: Package Specification; PartNumber: ADUM1401BRWZ; ComponentLink5URL: Reference Circuit:http://www.analog.com/en/interface-isolation/digital-isolators/adum1401/products/product.html#product-recommendations; Max Operating Temp (degreesC): 125; PackageReference: RW-16; PackageVersion: 032707-B, 03/2007; ComponentLink1Description: Manufacturer URL; Code_JEDEC: MS-013-AA; PackageDescription: 16-Pin Standard Small Outline Package, Body 10.3 x 7.5 mm, Pitch 1.27 mm; Mounting Technology: Surface Mount; ComponentLink1URL: http://www.analog.com/en/index.html; ComponentLink4Description: URL Link1; ComponentLink4URL: Product URL:http://www.analog.com/en/interface-isolation/digital-isolators/adum1401/products/product.html
U6 = STM32G030F6P6: SOIC-20
U7#1 = AMS1117
U8 U9 = MCP6001T: IC OPAMP GP 1 CIRCUIT SOT23-5; Number of Amplifiers: 1; Voltage: 6V; Power Supply Rejection Ratio (PSRR): 86dB; Common Mode Rejection Ratio: 60dB; Unity Gain Bandwidth Product: 1MHz; Slew Rate: 0.6V/µs; Output Current per Channel: 23mA; Nominal Supply Current: 100uA; Input Offset Voltage (Vos): 4.5mV; Input Bias Current: 1pA; Operating Supply Voltage: 5.5V; Min Supply Voltage: 1.8V; Voltage Gain: 112dB; Length: 3.1mm; REACH SVHC: No SVHC; Number of Pins: 5; Package Quantity: 1; Radiation Hardening: No; Mount: Surface Mount; Number of Circuits: 1; Number of Elements: 1; Output Current: 23mA; Packaging: Tape and Reel; Height: 1.3mm; Lead Free: Lead Free; Min Operating Temperature: -40°C; Bandwidth: 1MHz; Contact Plating: Tin; Max Supply Voltage: 6V; Max Operating Temperature: 85°C; Width: 1.8mm; Case/Package: SOT-23; Operating Supply Current: 100uA; Number of Channels: 1; Gain Bandwidth Product: 1MHz
VD65 VD67 = Suppressor
VD66 VD68 = ZENER